# EAGLE design MM_Main (EAGLE 7.2.0)
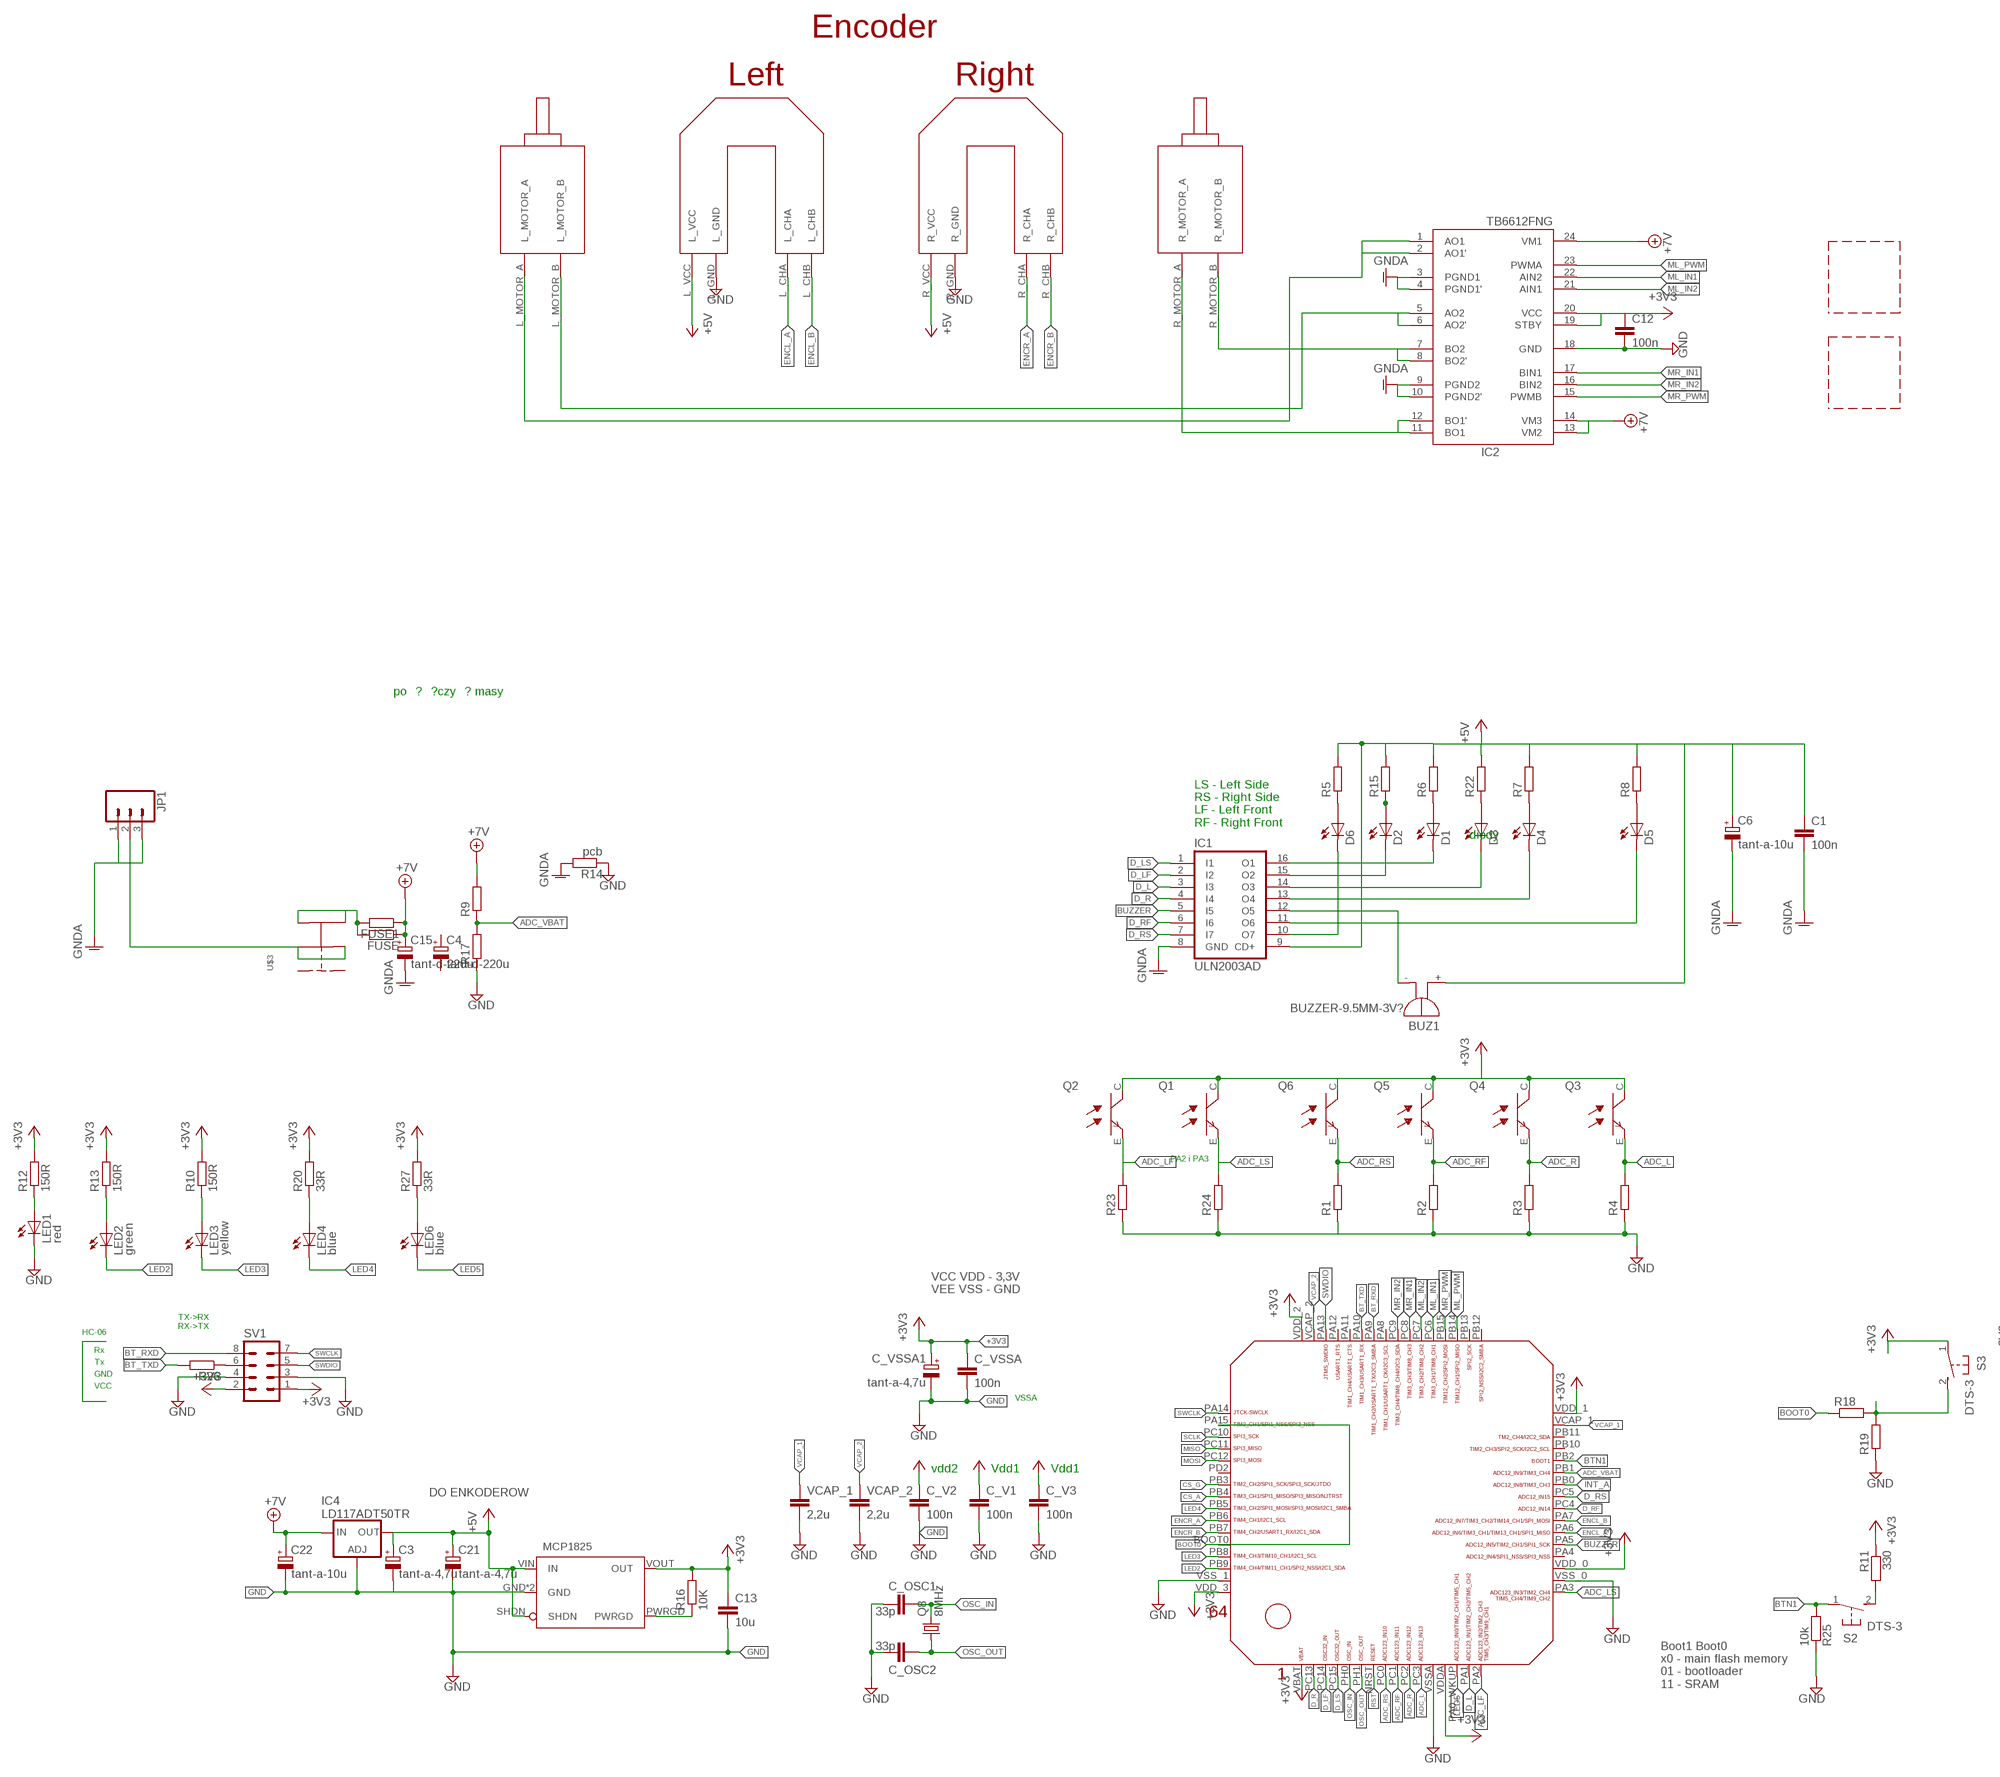
[diagram p0: schematic, sheet 1, part 1 of 2]
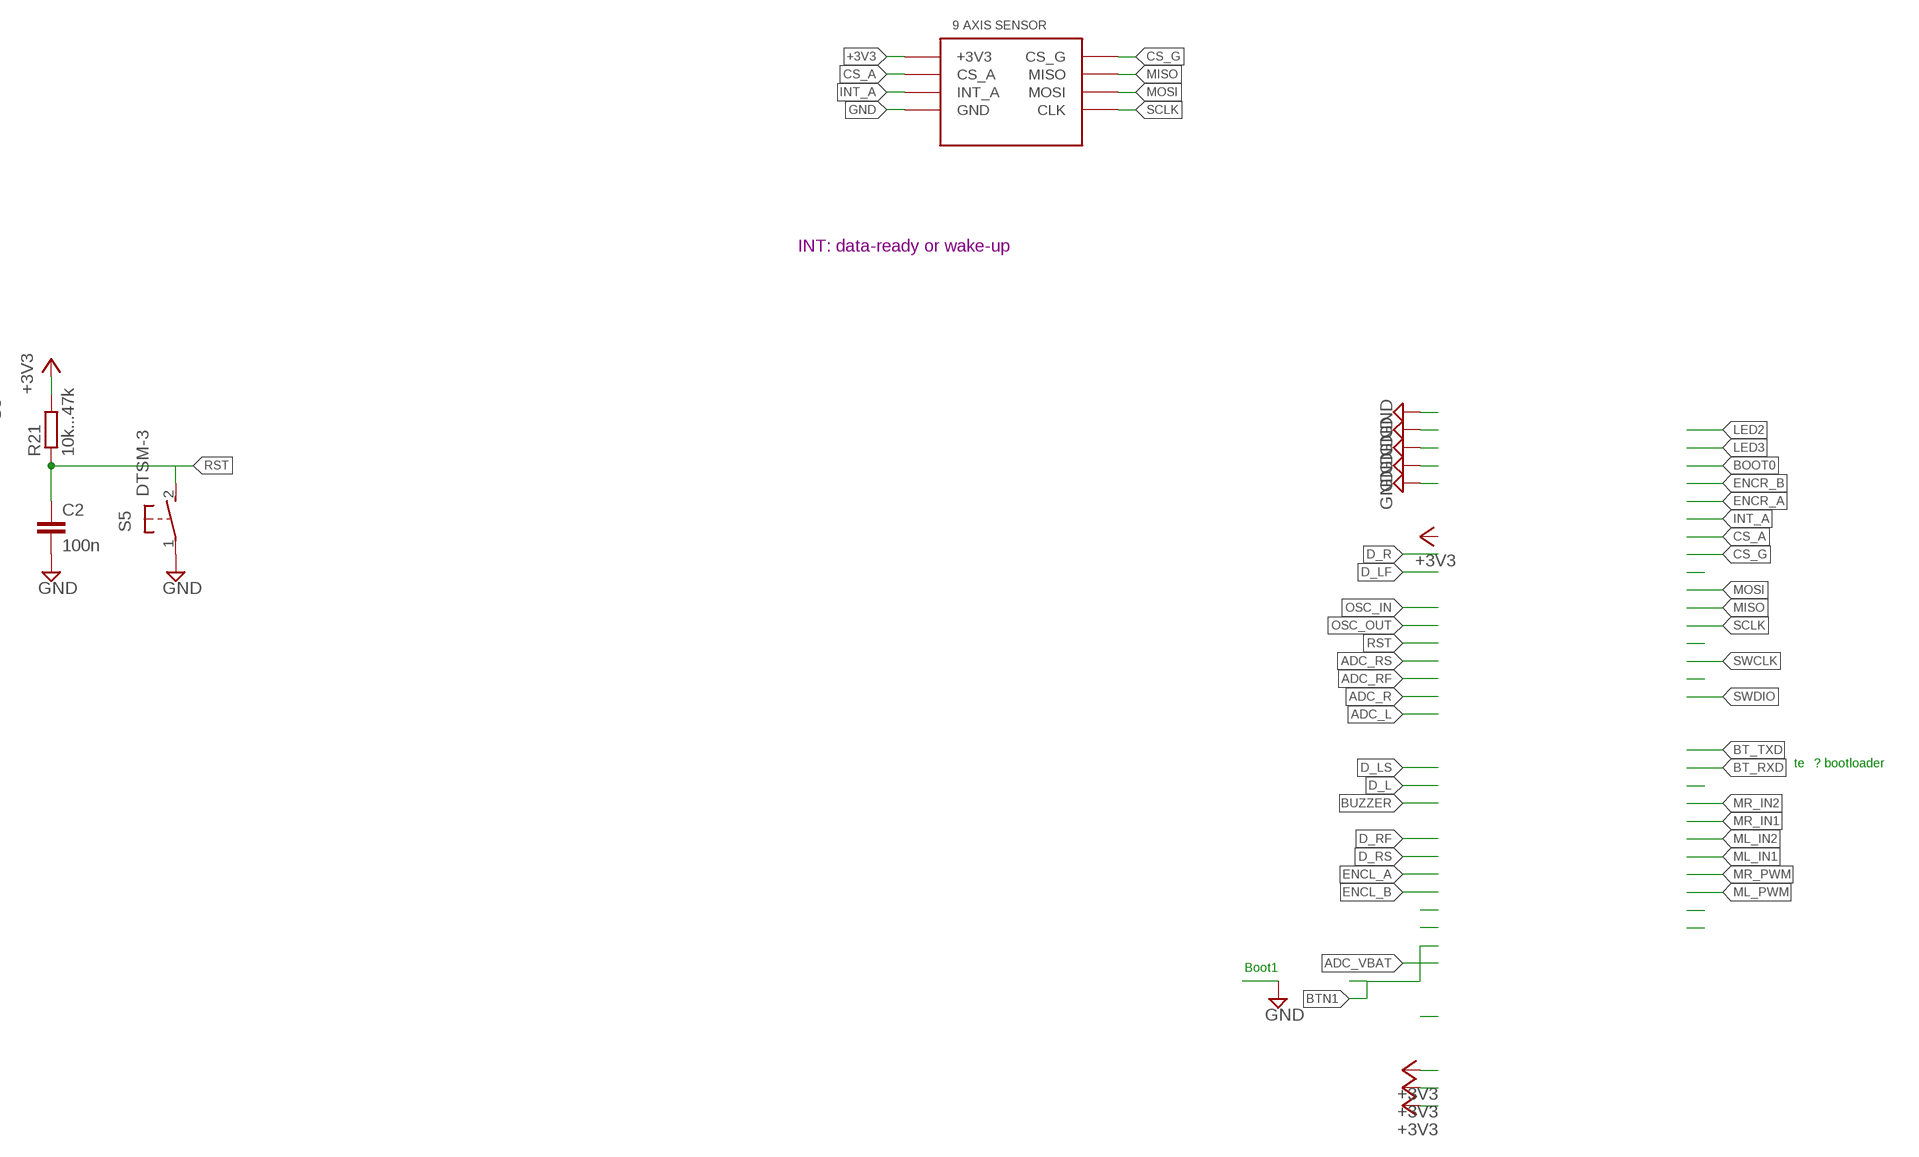
[diagram p1: schematic, sheet 1, part 2 of 2]

## Parts
BUZ1  BUZZER-9.5MM-3V?  BUZZER-9.5MM  [BUZZER-9.5MM]
C1  100n  C-EUC0805  [C0805]
C2  100n  C-EUC0805  [C0805]
C3  tant-a-4,7u  CPOL-EUSMCA  [SMC_A]
C4  tant-d-220u  CPOL-EUSMCD  [SMC_D]
C6  tant-a-10u  CPOL-EUSMCA  [SMC_A]
C12  100n  C-EUC0603  [C0603]
C13  10u  C-EUC0805  [C0805]
C15  tant-d-220u  CPOL-EUSMCD  [SMC_D]
C21  tant-a-4,7u  CPOL-EUSMCA  [SMC_A]
C22  tant-a-10u  CPOL-EUSMCA  [SMC_A]
C_OSC1  33p  C-EUC0805  [C0805]
C_OSC2  33p  C-EUC0805  [C0805]
C_V1  100n  C-EUC0805  [C0805]
C_V2  100n  C-EUC0805  [C0805]
C_V3  100n  C-EUC0805  [C0805]
C_VSSA  100n  C-EUC0805  [C0805]
C_VSSA1  tant-a-4,7u  CPOL-EUSMCA  [SMC_A]
D1  SFH4545-C  [SFH4545-C]
D2  SFH4545-C  [SFH4545-C]
D3  SFH4545-C  [SFH4545-C]
D4  SFH4545-C  [SFH4545-C]
D5  SFH4545-C  [SFH4545-C]
D6  SFH4545-C  [SFH4545-C]
FUSE  R-EU_M3516  [M3516]
FUSE1  R-EU_M3516  [M3516]
IC1  ULN2003AD  [SO16]
IC2  TB6612FNG  [SSOP24]
IC4  LD117ADT50TR  [DPACK]
IC5  MCP1825  [SOT223-5]
JP1  M03POLAR  [MOLEX-1X3]
L1  LABITYNT  [LABIRYNT]
L2  LABITYNT  [LABIRYNT]
LED1  red  LEDSML1206  [SML1206]
LED2  green  LEDSML1206  [SML1206]
LED3  yellow  LEDSML1206  [SML1206]
LED4  blue  LEDSML1206  [SML1206]
LED6  blue  LEDSML1206  [SML1206]
Q1  TEFT4300  [TEFT4300]
Q2  TEFT4300  [TEFT4300]
Q3  TEFT4300  [TEFT4300]
Q4  TEFT4300  [TEFT4300]
Q5  TEFT4300  [TEFT4300]
Q6  TEFT4300  [TEFT4300]
Q8  8MHz  CRYSTAL_5X3.2MM  [CRYSTAL_5X3.2MM]
R1  R-EU_R0805  [R0805]
R2  R-EU_R0805  [R0805]
R3  R-EU_R0805  [R0805]
R4  R-EU_R0805  [R0805]
R5  R-EU_R0805  [R0805]
R6  R-EU_R0805  [R0805]
R7  R-EU_R0805  [R0805]
R8  R-EU_R0805  [R0805]
R9  R-EU_R0805  [R0805]
R10  150R  R-EU_R0805  [R0805]
R11  330  R-EU_R0805  [R0805]
R12  150R  R-EU_R0805  [R0805]
R13  150R  R-EU_R0805  [R0805]
R14  pcb  R-EU_R0201  [R0201]
R15  R-EU_R0805  [R0805]
R16  10K  R-EU_R0805  [R0805]
R17  R-EU_R0805  [R0805]
R18  R-EU_R0805  [R0805]
R19  R-EU_R0805  [R0805]
R20  33R  R-EU_R0805  [R0805]
R21  10k...47k  R-EU_R0805  [R0805]
R22  R-EU_R0805  [R0805]
R23  R-EU_R0805  [R0805]
R24  R-EU_R0805  [R0805]
R25  10k  R-EU_R0805  [R0805]
R26  R-EU_R0805  [R0805]
R27  33R  R-EU_R0805  [R0805]
S2  DTS-3  [DTS-3]
S3  DTS-3  [DTS-3]
S5  DTSM-3  [DTSM-3]
SV1  MA04-2  [MA04-2]
U$1  9AXIS_MODULE  [9AXIS_SENSOR_MODULE]
U$3  PRZELACZNIK_SUWAKOWY  [PRZELACZNIK_SUWAKOWY]
U$5  MOTOR_MOUNT  [MOTOR_MOUNT]
U$6  STM32F4X5  [STM32F4-LQFP64]
VCAP_1  2,2u  C-EUC0805  [C0805]
VCAP_2  2,2u  C-EUC0805  [C0805]

## Nets
+3V3: C12.1 C13.1 C_V1.1 C_V2.1 C_V3.1 C_VSSA1.+ C_VSSA.1 IC2.19(STBY) IC2.20(VCC) IC5.VOUT(OUT) Q1.C Q2.C Q3.C Q4.C Q5.C Q6.C R10.2 R11.1 R12.2 R13.2 R16.2 R20.2 R21.2 R27.2 S3.1 SV1.1 SV1.2 U$1.P$1(+3V3) U$6.VBAT U$6.VDD_0 U$6.VDD_1 U$6.VDD_2 U$6.VDD_3 U$6.VDDA
+5V: BUZ1.+ C1.1 C3.+ C6.+ C21.+ IC1.9(CD+) IC4.4(OUT) IC5.SHDN IC5.VIN(IN) R5.2 R6.2 R7.2 R8.2 R15.2 R22.2 U$5.L_VCC U$5.R_VCC
+7V: C15.+ C22.+ FUSE1.1 FUSE.1 IC2.13(VM2) IC2.14(VM3) IC2.24(VM1) IC4.3(IN) R9.2
ADC_L: Q3.E R4.2 U$6.PC3
ADC_LF: Q2.E R23.2 U$6.PA2
ADC_LS: Q1.E R24.2 U$6.PA3
ADC_R: Q4.E R3.2 U$6.PC2
ADC_RF: Q5.E R2.2 U$6.PC1
ADC_RS: Q6.E R1.2 U$6.PC0
ADC_VBAT: R9.1 R17.2 U$6.PB1
BOOT0: R18.1 U$6.BOOT0 U$6.PA15
BT_RXD: SV1.8 U$6.PA9
BT_TXD: R26.2 U$6.PA10
BTN1: R25.2 S2.1 U$6.PB2
BUZZER: IC1.5(I5) U$6.PA5
CS_A: U$1.P$2(CS_A) U$6.PB4
CS_G: U$1.P$8(CS_G) U$6.PB3
D_L: IC1.3(I3) U$6.PA1
D_LF: IC1.2(I2) U$6.PC14
D_LS: IC1.1(I1) U$6.PC15
D_R: IC1.4(I4) U$6.PC13
D_RF: IC1.6(I6) U$6.PC4
D_RS: IC1.7(I7) U$6.PC5
ENCL_A: U$5.L_CHA U$6.PA6
ENCL_B: U$5.L_CHB U$6.PA7
ENCR_A: U$5.R_CHA U$6.PB6
ENCR_B: U$5.R_CHB U$6.PB7
GND: C2.2 C3.- C12.2 C13.2 C21.- C22.- C_OSC1.1 C_OSC2.1 C_V1.2 C_V2.2 C_V3.2 C_VSSA1.- C_VSSA.2 IC2.18(GND) IC4.1(ADJ) IC5.GND IC5.GND_TAB(GND) LED1.C R1.1 R2.1 R3.1 R4.1 R14.1 R17.1 R19.1 R23.1 R24.1 R25.1 S5.1 SV1.3 SV1.4 U$1.P$4(GND) U$5.L_GND U$5.R_GND U$6.VSS_0 U$6.VSS_1 U$6.VSSA VCAP_1.2 VCAP_2.2
GNDA: C1.2 C6.- C15.- IC1.8(GND) IC2.3(PGND1) IC2.4(PGND1') IC2.9(PGND2) IC2.10(PGND2') JP1.1 JP1.3 R14.2
INT_A: U$1.P$3(INT_A) U$6.PB0
LED2: LED2.C U$6.PB9
LED3: LED3.C U$6.PB8
LED4: LED4.C U$6.PB5
LED5: LED6.C U$6.PA0_WKUP(PA0_AKUP)
MISO: U$1.P$7(MISO) U$6.PC11
ML_IN1: IC2.22(AIN2) U$6.PC6
ML_IN2: IC2.21(AIN1) U$6.PC7
ML_PWM: IC2.23(PWMA) U$6.PB14
MOSI: U$1.P$6(MOSI) U$6.PC12
MR_IN1: IC2.17(BIN1) U$6.PC8
MR_IN2: IC2.16(BIN2) U$6.PC9
MR_PWM: IC2.15(PWMB) U$6.PB15
N$1: IC5.PWRGD R16.1
N$3: D2.ANODA(A) R15.1
N$4: D6.ANODA(A) R5.1
N$5: IC2.7(BO2) IC2.8(BO2') U$5.R_MOTOR_B
N$6: IC2.11(BO1) IC2.12(BO1') U$5.R_MOTOR_A
N$7: IC2.1(AO1) IC2.2(AO1') U$5.L_MOTOR_A
N$8: LED3.A R10.1
N$10: D1.ANODA(A) R6.1
N$11: D4.ANODA(A) R7.1
N$12: D5.ANODA(A) R8.1
N$17: LED1.A R12.1
N$18: IC2.5(AO2) IC2.6(AO2') U$5.L_MOTOR_B
N$19: BUZ1.- IC1.12(O5)
N$20: D3.ANODA(A) R22.1
N$21: LED2.A R13.1
N$22: LED4.A R20.1
N$23: R18.2 R19.2 S3.2
N$24: FUSE1.2 FUSE.2 U$3.3 U$3.6
N$26: R26.1 SV1.6
N$29: R11.2 S2.2
N$31: LED6.A R27.1
N$36: JP1.2 U$3.2 U$3.5
OSC_IN: C_OSC1.2 Q8.P$2 U$6.PH0
OSC_OUT: C_OSC2.2 Q8.P$1 U$6.PH1
RST: C2.1 R21.1 S5.2 U$6.NRST
SCLK: U$1.P$5(CLK) U$6.PC10
SENSOR_L: D3.KATODA(C) IC1.14(O3)
SENSOR_LF: D2.KATODA(C) IC1.15(O2)
SENSOR_LS: D1.KATODA(C) IC1.16(O1)
SENSOR_R: D4.KATODA(C) IC1.13(O4)
SENSOR_RF: D5.KATODA(C) IC1.11(O6)
SENSOR_RS: D6.KATODA(C) IC1.10(O7)
SWCLK: SV1.7 U$6.PA14
SWDIO: SV1.5 U$6.PA13
VCAP_1: U$6.VCAP_1 VCAP_1.1
VCAP_2: U$6.VCAP_2 VCAP_2.1
Unconnected: C4.+ C4.- U$3.1 U$3.4 U$6.PA4 U$6.PA8 U$6.PA11 U$6.PA12 U$6.PB10 U$6.PB11 U$6.PB12 U$6.PB13 U$6.PD2

## Notes on the sheet
- po�?�?czy�? masy
- LS - Left Side
  RS - Right Side
  LF - Left Front
  RF - Right Front
- diody
- PA2 i PA3
- INT: data-ready or wake-up
- VCC VDD - 3,3V
  VEE VSS - GND
- HC-06
- TX->RX
  RX->TX
- Rx
- Tx
- GND
- VCC
- VSSA
- vdd2 | Vdd1 | Vdd1
- DO ENKODEROW
- te�? bootloader
- Boot1 Boot0
  x0 - main flash memory
  01 - bootloader
  11 - SRAM
- Boot1

## Library data of the parts
BUZ1 = _microMouse:BUZZER-9.5MM
C1 C2 C12 C13 C_OSC1 C_OSC2 C_V1-C_V3 C_VSSA VCAP_1 VCAP_2 = rcl:C-EU: CAPACITOR, European symbol
C3 C4 C6 C15 C21 C22 C_VSSA1 = rcl:CPOL-EU: POLARIZED CAPACITOR, European symbol
D1-D6 = _microMouse:SFH4545
FUSE FUSE1 R9-R14 R16 R17 R20 R27 = resistor:R-EU_: RESISTOR, European symbol
IC1 = uln-udn:ULN2003A: DRIVER ARRAY
IC2 = _microMouse:TB6612FNG: TB6612FNG MOS dual H-bridge motor driver, 1.2A current 3.2A peak 3 or 5v logic and 3-15v motor
IC4 = v-reg:LD117A?*: Low drop fixed and adjustable positive voltage regulators 1 A Source: http://www.st.com/stonline/products/literature/ds/7194/ld1117axx.pdf
IC5 = _microMouse:MCP1825
JP1 = SparkFun-Connectors:M03: Header 3 Standard 3-pin 0.1" header. Use with straight break away headers (SKU : PRT-00116), right angle break away headers (PRT-00553), swiss pins (PRT-00743), machine pins (PRT-00117), and female headers (PRT-00115). Molex polarized connector foot print use with SKU : PRT-08232 with associated crimp pins and housings.
L1 L2 = _microMouse:LABITYNT
LED1-LED4 LED6 = led:LED: LED OSRAM: - CHIPLED LG R971, LG N971, LY N971, LG Q971, LY Q971, LO R971, LY R971 LH N974, LH R974 LS Q976, LO Q976, LY Q976 LO Q996 - Hyper CHIPLED LW Q18S LB Q993, LB Q99A, LB R99A - SideLED LS A670, LO A670, LY A670, LG A670, LP A670 LB A673, LV A673, LT A673, LW A673 LH A674 LY A675 LS A676, LA A676, LO A676, LY A676, LW A676 LS A679, LY A679, LG A679 - Hyper Micro SIDELED�? LS Y876, LA Y876, LO Y876, LY Y876 LT Y87S - SmartLED LW L88C, LW L88S LB L89C, LB L89S, LG L890 LS L89K, LO L89K, LY L89K LS L896, LA L896, LO L896, LY L896 - TOPLED LS T670, LO T670, LY T670, LG T670, LP T670 LSG T670, LSP T670, LSY T670, LOP T670, LYG T670 LG T671, LOG T671, LSG T671 LB T673, LV T673, LT T673, LW T673 LH T674 LS T676, LA T676, LO T676, LY T676, LB T676, LH T676, LSB T676, LW T676 LB T67C, LV T67C, LT T67C, LS T67K, LO T67K, LY T67K, LW E67C LS E67B, LA E67B, LO E67B, LY E67B, LB E67C, LV E67C, LT E67C LW T67C LS T679, LY T679, LG T679 LS T770, LO T770, LY T770, LG T770, LP T770 LB T773, LV T773, LT T773, LW T773 LH T774 LS E675, LA E675, LY E675, LS T675 LS T776, LA T776, LO T776, LY T776, LB T776 LHGB T686 LT T68C, LB T68C - Hyper Mini TOPLED�? LB M676 - Mini TOPLED Santana�? LG M470 LS M47K, LO M47K, LY M47K Source: http://www.osram.convergy.de LUXEON: - LUMILED�? LXK2-PW12-R00, LXK2-PW12-S00, LXK2-PW14-U00, LXK2-PW14-V00 LXK2-PM12-R00, LXK2-PM12-S00, LXK2-PM14-U00 LXK2-PE12-Q00, LXK2-PE12-R00, LXK2-PE12-S00, LXK2-PE14-T00, LXK2-PE14-U00 LXK2-PB12-K00, LXK2-PB12-L00, LXK2-PB12-M00, LXK2-PB14-N00, LXK2-PB14-P00, LXK2-PB14-Q00 LXK2-PR12-L00, LXK2-PR12-M00, LXK2-PR14-Q00, LXK2-PR14-R00 LXK2-PD12-Q00, LXK2-PD12-R00, LXK2-PD12-S00 LXK2-PH12-R00, LXK2-PH12-S00 LXK2-PL12-P00, LXK2-PL12-Q00, LXK2-PL12-R00 Source: www.luxeon.com KINGBRIGHT: KA-3528ASYC Source: www.kingbright.com
Q1-Q6 = _MM:TEFT4300
Q8 = _microMouse:CRYSTAL_5X3.2MM
R1-R8 R15 R18 R19 R21-R26 = rcl:R-EU_: RESISTOR, European symbol
S2 S3 = switch-tact:DTS-3
S5 = switch-tact:DTSM-3
SV1 = con-lstb:MA04-2: PIN HEADER; OC_FARNELL: unknown; OC_NEWARK: unknown
U$1 = _microMouse:9AXIS_MODULE
U$3 = _microMouse:PRZELACZNIK_SUWAKOWY
U$5 = _microMouse:MOTOR_MOUNT
U$6 = _microMouse:STM32F4X5

## Board
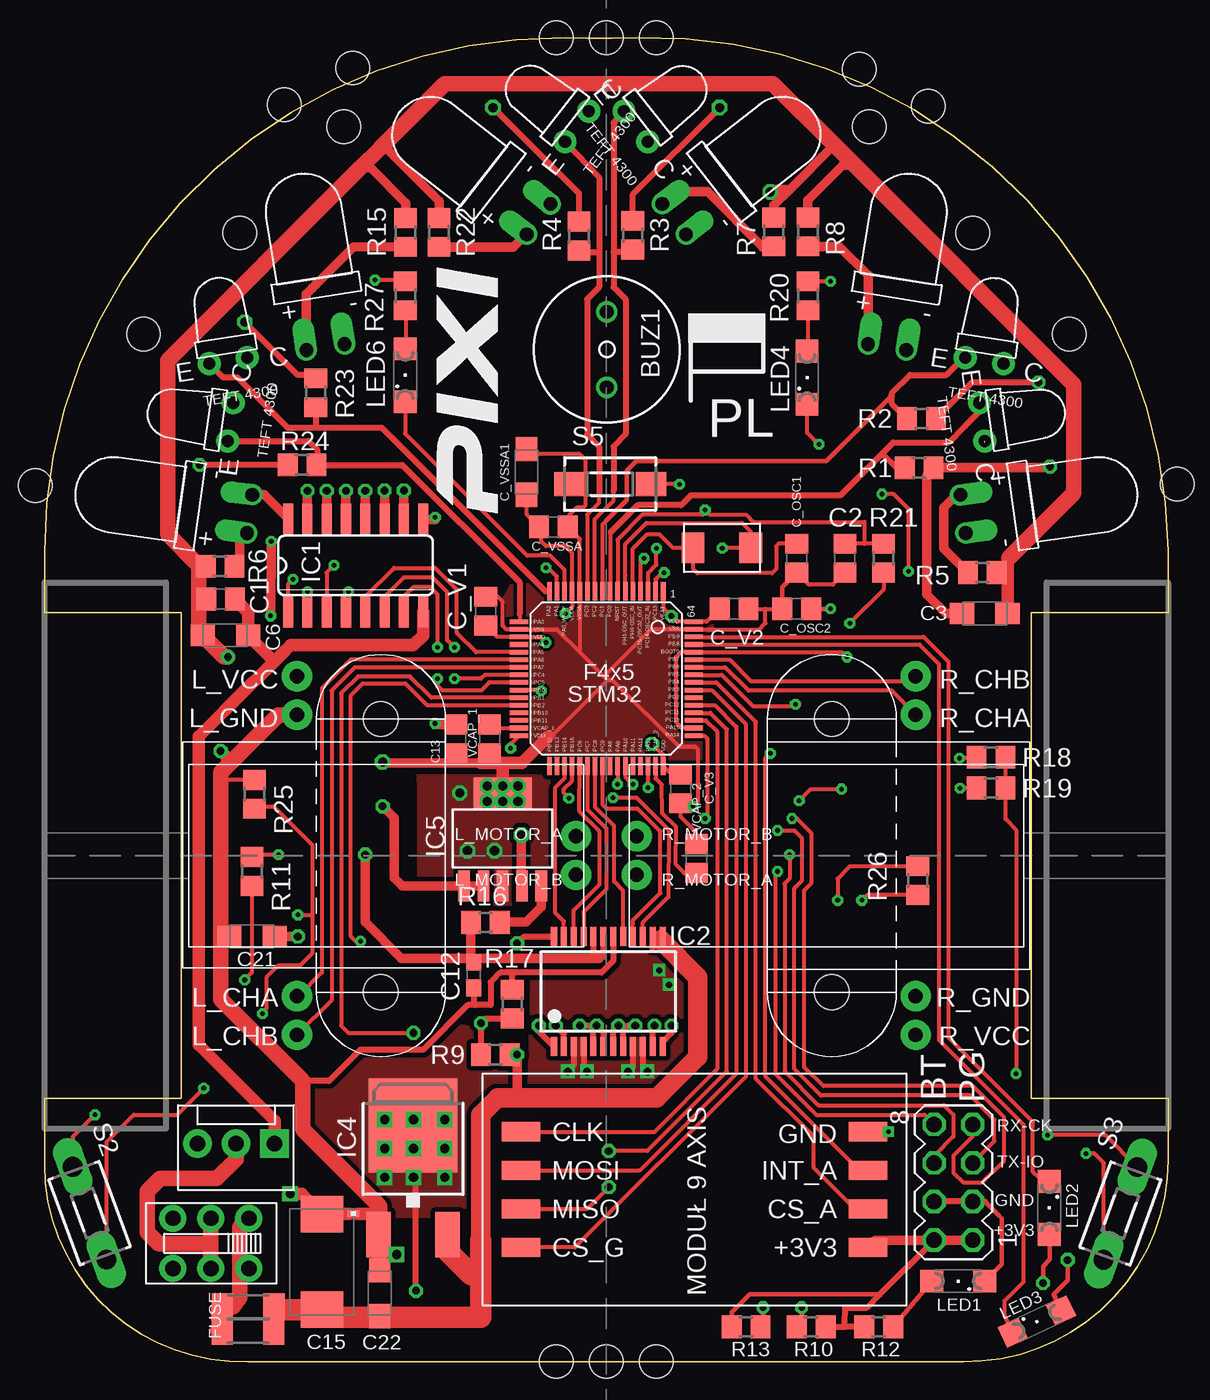
[diagram p2: board, top side]
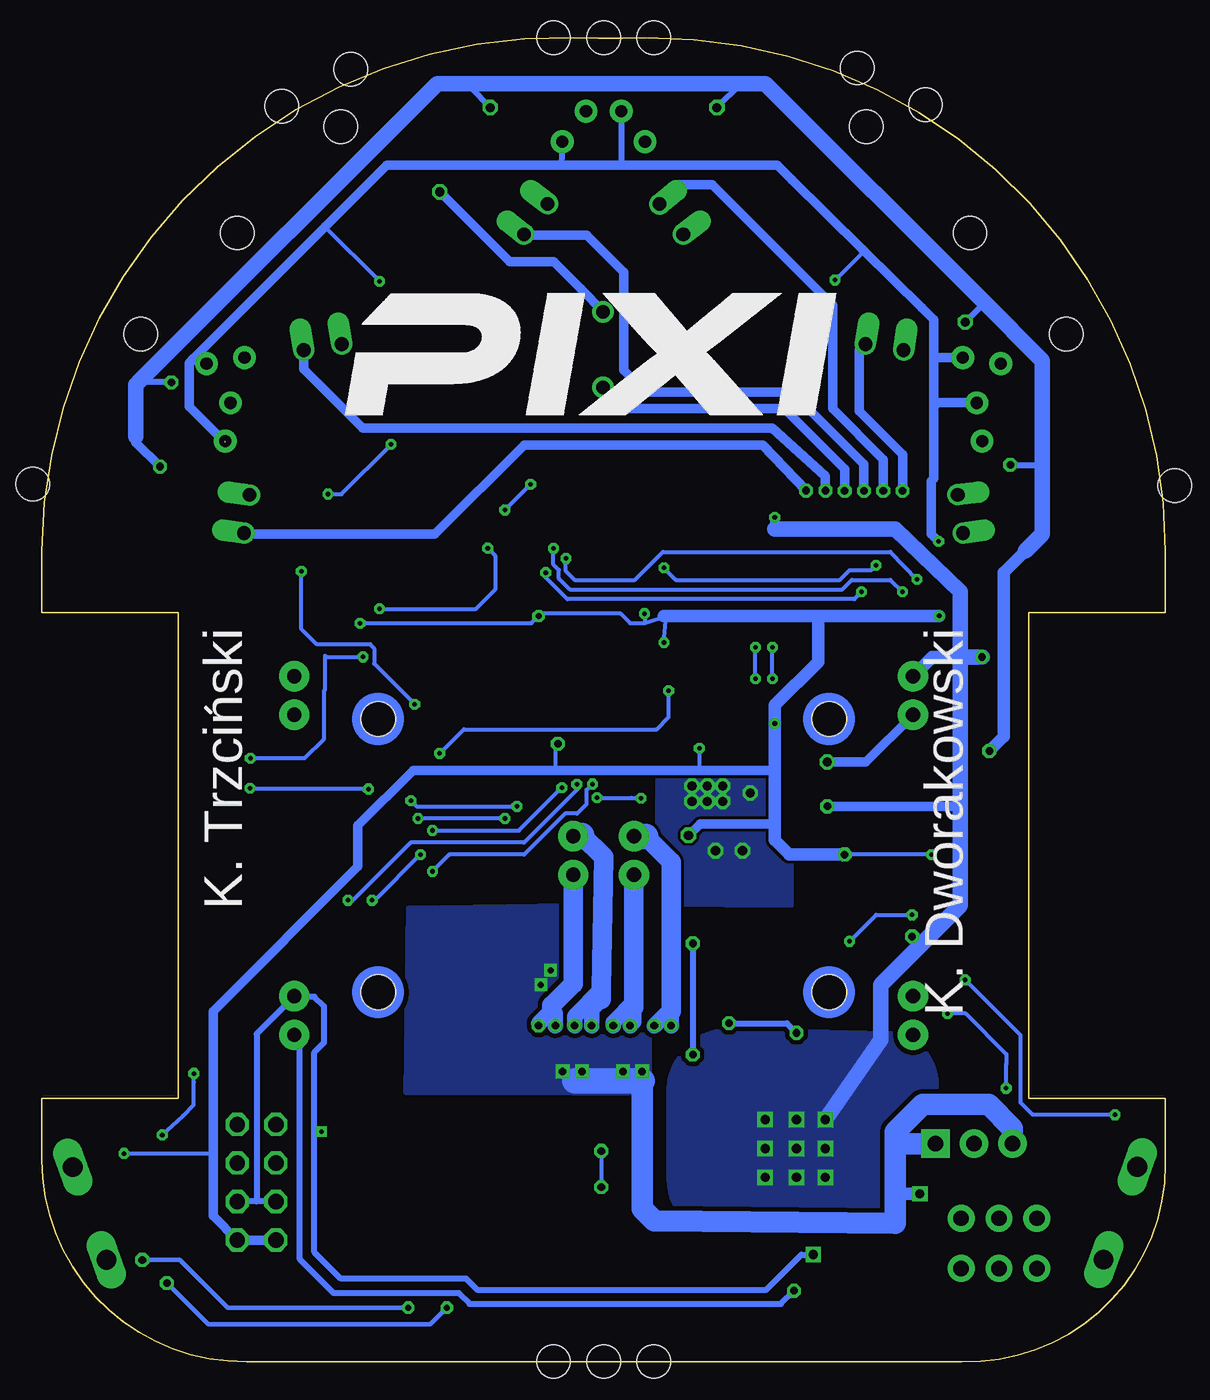
[diagram p3: board, bottom side, seen from below]

Size 74 x 87.2 mm. Coordinates in mm from the lower left corner, seen from the top.
Outline: 0,13.4 0,13 arc92 13.4,0 60.5,0 arc91 74,13.3 74,13.4
Outline: 0,53.3 0,53.4 arc-91 34.2,87.2
Outline: 74,53.3 74,53.4 arc91 39,87.2 arc-2 34.1,87.2
Copper layers (1*16): Top 0.035mm / dielectric 1.5mm / Bottom 0.035mm
Design rules "default *": minimum track width 10mil, minimum drill 0.3mm, track to track 8mil, track to pad 8mil, pad to pad 7mil, via to via 8mil, smd to smd 0mil, copper to edge 12mil, drill to drill 8mil, minimum pad ring 10mil, minimum via ring 8mil, stop-mask expansion 4mil, vias tented up to drill 0mil, thermal gap 10mil
Holes 2.2 mm at 19.7,81.34 12.87,74.36 6.52,67.69 54.3,81.34 61.13,74.36 67.48,67.69 20.29,85.22 15.8,82.8 -0.6,57.7 53.66,85.15 58.2,82.7 74.6,57.8 37,87.2 33.7,87.2 40.3,87.2 37,0 33.7,0 40.3,0

### Footprints (pad centres in the part's own frame; a part is rotated, then mirrored left to right if it is on the bottom)
BUZZER-9.5MM = drill 0.9: + -2.481,0; - 2.499,0
C0805 = smd 1.3 x 1.5: 1 -0.95,0; 2 0.95,0
SMC_A = smd 1.6 x 1.4: + -1.5,0; - 1.5,0
SMC_D = smd 2.4 x 2.8: + -3.15,0; - 3.15,0
C0603 = smd 1.1 x 1: 1 -0.85,0; 2 0.85,0
SFH4545-C = drill 0.9 offset: ANODA -1.27,-0.76; KATODA 1.27,-0.76
M3516 = smd 1.4 x 1.8: 1 -1.7,0; 2 1.7,0
SO16 = smd 0.66 x 2.032: 1 -4.445,-3.073; 2 -3.175,-3.073; 3 -1.905,-3.073; 4 -0.635,-3.073; 5 0.635,-3.073; 6 1.905,-3.073; 7 3.175,-3.073; 8 4.445,-3.073; 9 4.445,3.073; 10 3.175,3.073; 11 1.905,3.073; 12 0.635,3.073; 13 -0.635,3.073; 14 -1.905,3.073; 15 -3.175,3.073; 16 -4.445,3.073
SSOP24 = smd 0.4 x 1.25: 1 -3.575,-3.625; 2 -2.925,-3.625; 3 -2.275,-3.625; 4 -1.625,-3.625; 5 -0.975,-3.625; 6 -0.325,-3.625; 7 0.325,-3.625; 8 0.975,-3.625; 9 1.625,-3.625; 10 2.275,-3.625; 11 2.925,-3.625; 12 3.575,-3.625; 13 3.575,3.625; 14 2.925,3.625; 15 2.275,3.625; 16 1.625,3.625; 17 0.975,3.625; 18 0.325,3.625; 19 -0.325,3.625; 20 -0.975,3.625; 21 -1.625,3.625; 22 -2.275,3.625; 23 -2.925,3.625; 24 -3.575,3.625
DPACK = smd 1.6 x 3: 1 -2.28,-4.8; 3 2.28,-4.8 | smd 5.8 x 6.2: 4 0,2.38
SOT223-5 = smd 0.762 x 2.032: GND 0.095,-3.365; PWRGD 2.635,-3.365; SHDN -2.445,-3.365; VIN -1.175,-3.365; VOUT 1.365,-3.365 | smd 3.81 x 2.007: GND_TAB 0.095,2.777
MOLEX-1X3 = drill 1.016 pad 1.88 square: 1 0,0 | drill 1.016 pad 1.88: 2 2.54,0; 3 5.08,0
SML1206 = smd 1.5 x 1.5: A 1.75,0; C -1.75,0
TEFT4300 = drill 0.8 pad 1.5: C 1.27,-1.77; E -1.27,-1.77
CRYSTAL_5X3.2MM = smd 1.5 x 2: P$1 2.1,0.13; P$2 -1.7,0.13
R0805 = smd 1.3 x 1.5: 1 -0.95,0; 2 0.95,0
R0201 = smd 0.28 x 0.43: 1 -0.255,0; 2 0.255,0
DTS-3 = drill 1.3 long: 1 -3.25,0; 2 3.25,0
DTSM-3 = smd 2 x 1.6: 1 -2.7,0; 2 2.7,0
MA04-2 = drill 1.016 octagon: 1 -3.81,-1.27; 2 -3.81,1.27; 3 -1.27,-1.27; 4 -1.27,1.27; 5 1.27,-1.27; 6 1.27,1.27; 7 3.81,-1.27; 8 3.81,1.27
9AXIS_SENSOR_MODULE = smd 2.54 x 1.27: P$1 -11.43,3.81; P$2 -11.43,1.27; P$3 -11.43,-1.27; P$4 -11.43,-3.81; P$5 11.43,-3.81; P$6 11.43,-1.27; P$7 11.43,1.27; P$8 11.43,3.81
PRZELACZNIK_SUWAKOWY = drill 1 pad 1.778: 1 -1.23,0; 2 1.27,0; 3 3.77,0; 4 -1.23,-3.3; 5 1.27,-3.3; 6 3.77,-3.3
MOTOR_MOUNT = drill 0.95 pad 2: L_CHA -20.375,-10.1; L_CHB -20.375,-12.64; L_GND -20.375,8.44; L_MOTOR_A -2,0.44; L_MOTOR_B -2,-2.1; L_VCC -20.375,10.98; R_CHA 20.375,8.44; R_CHB 20.375,10.98; R_GND 20.375,-10.1; R_MOTOR_A 2,-2.1; R_MOTOR_B 2,0.44; R_VCC 20.375,-12.64 | hole 2.286: 14.85,8.17; 14.85,-9.83; -14.85,-9.83; -14.85,8.17
STM32F4-LQFP64 = smd 1.2 x 0.3: BOOT0 -5.75,-1.75; PA3 5.75,-3.75; PA4 5.75,-2.25; PA5 5.75,-1.75; PA6 5.75,-1.25; PA7 5.75,-0.75; PA14 -5.75,3.75; PA15 -5.75,3.25; PB0 5.75,0.75; PB1 5.75,1.25; PB2 5.75,1.75; PB3 -5.75,0.75; PB4 -5.75,0.25; PB5 -5.75,-0.25; PB6 -5.75,-0.75; PB7 -5.75,-1.25; PB8 -5.75,-2.25; PB9 -5.75,-2.75; PB10 5.75,2.25; PB11 5.75,2.75; PC4 5.75,-0.25; PC5 5.75,0.25; PC10 -5.75,2.75; PC11 -5.75,2.25; PC12 -5.75,1.75; PD2 -5.75,1.25; VCAP_1 5.75,3.25; VDD_0 5.75,-2.75; VDD_1 5.75,3.75; VDD_3 -5.75,-3.75; VSS_0 5.75,-3.25; VSS_1 -5.75,-3.25 | smd 0.3 x 1.2: NRST -0.75,-5.75; PA0_WKUP 2.75,-5.75; PA1 3.25,-5.75; PA2 3.75,-5.75; PA8 -0.25,5.75; PA9 -0.75,5.75; PA10 -1.25,5.75; PA11 -1.75,5.75; PA12 -2.25,5.75; PA13 -2.75,5.75; PB12 3.75,5.75; PB13 3.25,5.75; PB14 2.75,5.75; PB15 2.25,5.75; PC0 -0.25,-5.75; PC1 0.25,-5.75; PC2 0.75,-5.75; PC3 1.25,-5.75; PC6 1.75,5.75; PC7 1.25,5.75; PC8 0.75,5.75; PC9 0.25,5.75; PC13 -3.25,-5.75; PC14 -2.75,-5.75; PC15 -2.25,-5.75; PH0 -1.75,-5.75; PH1 -1.25,-5.75; VBAT -3.75,-5.75; VCAP_2 -3.25,5.75; VDD_2 -3.75,5.75; VDDA 2.25,-5.75; VSSA 1.75,-5.75

### Placement (x,y rotation side)
BUZ1  37.03,66.68 270 top
C1  11.6,50.23 0 top
C2  52.72,52.93 270 top
C3  61.92,49.27 180 top
C4  -233.26,-67.18 0 top  (outside the outline)
C6  11.92,47.85 0 top
C12  28.27,25.46 270 top
C13  27.09,41.02 270 top
C15  18.27,6.57 90 top
C21  13.66,28 180 top
C22  22.08,4.51 90 top
C_OSC1  49.54,52.93 90 top
C_OSC2  49.54,49.59 0 top
C_V1  29.06,49.43 90 top
C_V2  45.41,49.59 0 top
C_V3  41.89,37.73 270 top
C_VSSA  33.51,54.99 0 top
C_VSSA1  31.75,58.61 90 top
D1  12.75,55.95 82 top
D2  18.39,67.59 9 top
D3  31.94,75.73 52 top
D4  42.07,75.74 308 top
D5  55.61,67.58 351 top
D6  61.25,55.94 278 top
FUSE  13.4,2.01 180 top
FUSE1  13.41,3.61 180 top
IC1  20.49,52.45 0 top
IC2  37.13,24.38 0 top
IC4  24.27,13.18 0 top
IC5  30.08,34.7 0 top
JP1  15.16,14.35 180 top
L1  217.5,32.92 0 top  (outside the outline)
L2  37,33.24 0 top
LED1  60.18,5.3 180 top
LED2  66.18,10.13 270 top
LED3  65.35,2.63 25 top
LED4  50.22,64.81 90 top
LED6  23.75,64.97 90 top
Q1  10.5,62.15 82 top
Q2  11.82,67.69 9 top
Q3  33.67,82.45 52 top
Q4  40.33,82.45 308 top
Q5  62.18,67.69 351 top
Q6  63.5,62.15 278 top
Q8  44.41,53.48 0 top
R1  57.6,58.88 180 top
R2  57.76,62.13 180 top
R3  38.75,74.2 270 top
R4  35.2,74.14 270 top
R5  61.77,51.97 0 top
R6  11.57,52.4 180 top
R7  48.02,74.41 90 top
R8  50.28,74.41 90 top
R9  29.7,20.22 0 top
R10  50.49,2.29 0 top
R11  13.66,32.29 270 top
R12  54.94,2.29 180 top
R13  46.21,2.29 180 top
R14  20.33,9.75 180 top
R15  23.77,74.38 90 top
R16  29.03,28.92 180 top
R17  30.81,23.56 270 top
R18  62.34,39.81 0 top
R19  62.34,37.78 0 top
R20  50.28,70.2 90 top
R21  55.26,52.93 270 top
R22  25.98,74.38 90 top
R23  17.86,63.82 270 top
R24  16.96,59.07 0 top
R25  13.82,37.37 270 top
R26  57.51,31.69 270 top
R27  23.77,70.2 90 top
S2  2.96,9.78 110 top
S3  70.86,9.75 70 top
S5  37.25,57.81 0 top
SV1  59.86,11.81 90 top
U$1  42.81,11.33 180 top
U$3  9.69,9.43 0 top
U$5  37,34.16 0 top
U$6  37,44.99 180 top
VCAP_1  29.31,41.02 270 top
VCAP_2  42.94,33.15 90 top

### Tracks (layer width: path | path; a pad name or v marks a point on that pad's centre or on a via)
+3V3  (via drill 0.3, 0.4, 0.5, 0.6)  (1 unrouted)
  Top 0.254: R11.1 13.67,33.4 v15.41,33.4 | v34.3,49.27 34.75,49.72 U$6.VDDA 34.75,53.27 34.3,53.72 33.03,53.72 32.71,54.04 32.71,54.83 C_VSSA.1 31.75,55.8 C_VSSA1.+ | v33.03,47.37 32.66,47.74 U$6.VDD_0 29.81,47.74 C_V1.1 | C_V2.1 43.61,48.74 U$6.VDD_3 41.66,48.74 v41.29,49.12 40.75,49.65 U$6.VBAT | v40.02,40.7 40.75,39.97 U$6.VDD_2 41.51,38.48 C_V3.1 | R21.2 55.26,50.86 v53.03,48.64 | R27.2 23.68,71.25 v21.76,71.25 | R20.2 50.3,71.17 v51.76,71.17 | U$6.VDD_1 30.7,40.69 v30.7,40.4 | 68.59,13.52 v68.59,13.71 69.13,13.71 69.77,13.08 69.77,6.97 S3.1
  Top 0.305: C12.1 28.27,26.41 28.11,26.57 | R13.2 45.26,3.24 46.45,4.43 55.02,4.43
  Top 0.406: IC2.20 36.15,26.84 36.05,26.73 36.68,26.73 36.8,26.85 IC2.19 | R10.2 52.72,2.29 | SV1.2 55.02,4.43 54.14,3.55 52.72,3.56 52.72,2.44 52.72,2.29 | R12.2 52.72,2.29 | C_VSSA.1 32.08,55.47
  Top 0.61: 36.68,26.73 36.52,26.57 28.11,26.57 23.51,26.57 21.12,28.95 v21.12,33.4 | v14.9,49.12 v14.93,54.04 | SV1.1 SV1.2 54.72,8 U$1.P$1 | IC5.VOUT 31.41,31.3 | 31.41,31.3 31.46,31.25 | R16.2 28.08,26.5 C12.1 | 31.41,31.3 v31.41,34.67 | C13.1 25.8,41.97 v25.73,42.04
  Bottom 0.254: 34.3,48.64 35.25,48.64 35.89,49.27 41.13,49.27 v41.29,49.12 41.76,48.64 v53.03,48.64 | 34.3,48.64 32.87,49.12 v33.03,47.37 | v15.41,33.4 v21.12,33.4 | v34.3,49.27 34.3,48.64 | v40.02,40.7 40.17,40.54 40.17,38.95 | v68.59,13.71 62.72,13.71 | v21.76,71.25 19.85,73.16 19.85,73.17 | v51.76,71.17 55.34,74.75 | v30.7,40.4 30.7,38.95
  Bottom 0.406: Q3.C 35.84,78.91 35.73,78.8 | Q4.C 39.79,78.8 | 39.79,78.8
  Bottom 0.61: SV1.2 SV1.1 62.72,9.59 62.72,13.71 62.72,23.08 53.19,32.61 53.19,35.3 49.54,38.96 49.06,38.95 40.17,38.95 30.7,38.95 25.73,38.95 25.73,38.96 | 61.92,60.55 64.31,62.93 64.31,65.78 63.99,66.1 | v14.93,54.04 15.41,54.51 15.41,58.01 15.25,58.16 15.25,62.93 | 15.25,62.93 15.25,65.94 | 15.25,65.94 15.25,68.64 16.05,69.44 19.85,73.17 19.98,73.29 24.62,77.85 25.57,78.8 35.73,78.8 39.79,78.8 51.29,78.8 55.34,74.75 63.99,66.1 | Q1.C 15.02,63.16 15.25,62.93 | Q2.C 15.05,66.14 15.25,65.94 | Q5.C 63.63,65.74 63.99,66.1 | 25.73,34.35 25.82,34.45 25.82,35.43 30.65,35.43 v31.41,34.67
  Bottom 0.813: 33.03,49.12 32.87,49.12 22.87,49.12 | 22.87,49.12 v14.9,49.12 | v21.12,33.4 24.78,33.4 25.73,34.35 25.73,38.96 25.73,41.53 v25.73,42.04 25.73,43.24 22.87,46.1 22.87,49.12
+5V  (via drill 0.3, 0.5, 0.6)
  Top 0.406: v24.46,4.67 24.46,13.87 v24.3,14.03
  Top 0.61: IC1.9 24.99,55.47 25.73,55.47 v25.73,55.62 | C21.+ v16.68,28 | C3.+ 63.35,49.27 | 49.06,77.22 52,80.15 | v47.8,77.06 47.95,77.22 49.06,77.22 | 50.28,75.73 R8.2 50.26,75.38 50.26,76.5 52.56,78.8 53.35,78.8 | R7.2 48.02,76.17 49.06,77.22 | 20.81,78.64 21.47,78.64 23.79,76.33 23.79,75.36 R15.2 | 22.08,79.91 22.54,79.91 26,76.45 26,75.35 R22.2 | IC5.VIN IC5.SHDN 23.57,31.34 23.03,31.88 23.03,35.81 v22.27,36.57
  Top 0.813: C3.+ 63.42,51.97 | 63.42,51.97 63.42,52.84 63.51,52.93 64.46,53.88 | R5.2 63.42,51.97
  Top 1.016: v22.39,15.94 23.03,17.05 | v22.39,15.94 v24.3,15.94 | v22.39,14.03 v24.3,14.03 25.73,14.03 24.68,15.08 IC4.4 24.27,15.65 v22.39,15.94 | 63.51,52.93 67.8,57.21 67.8,64.36 53.35,78.8 52,80.15 47.95,84.2 26.36,84.2 22.08,79.91 20.81,78.64 8.11,65.94 8.11,54.51 10.17,52.45 10.17,52.29 | v12.08,46.42 11.85,46.42 C6.+ 10.17,48.09 10.17,50.23 | 10.17,52.29 10.17,50.23 | C1.1 10.17,50.23 | R6.2 10.28,52.4 10.17,52.29
  Bottom 0.406: U$5.R_VCC 57,21.15 57,6.73 54.78,4.51 46.52,4.51 45.82,3.8 25.32,3.8 v24.46,4.67
  Bottom 0.61: v25.73,55.62 25.73,54.83 | v16.68,28 16.52,28 16.12,27.45 | BUZ1.+ 38.5,70.68 40.27,72.45 43.19,72.45 v47.8,77.06 | v22.27,36.57 13.63,36.57 13.5,36.7
  Bottom 0.813: U$5.L_VCC 15.35,46.42 13.5,46.42
  Bottom 1.016: 25.73,54.83 17.79,54.83 13.51,50.72 13.51,49.28 13.5,49.27 13.5,46.42 | v22.39,15.94 18.74,21.18 18.74,24.83 16.12,27.45 13.5,30.07 13.5,36.7 13.5,46.42 | v12.08,46.42 13.5,46.42
  other vias: 26.36,15.94 26.36,14.03 26.36,12.13 24.3,12.13 22.39,12.13
  pour Top (isolate 0.305, no thermals): 14.77,19.91 14.77,14.03 arc90 19.22,9.59 25.89,9.59 arc90 32.08,15.78 32.08,16.73 arc90 26.68,22.13 16.2,22.13 arc90 14.77,20.7
  pour Bottom (isolate 0.305): 15.41,11.65 arc90 19.38,7.68 28.46,7.68 arc90 32.71,12.45 32.71,18 arc90 28.3,21.91 18.43,21.65 arc90 15.09,18.32
+7V  (via drill 0.5)
  Top 0.254: C22.+ 22.08,2.92
  Top 0.406: IC2.14 40.05,27.24 40.57,27.76 40.07,28.21 IC2.13 | IC2.24 31.59,28.01 v31.13,27.54 | R9.2 31.13,19.27
  Top 0.61: v31.13,20.22 31.13,19.27 31.13,17.52 30.97,17.37
  Top 1.27: 28.74,8 28.74,16.25 29.86,17.37 30.97,17.37 40.33,17.37 43.03,20.06 43.03,25.3 40.57,27.76
  Top 1.422: 28.74,5.71 28.74,2.92 22.08,2.92 18.11,2.92 C15.+ 15.19,3.42 FUSE1.1 15.11,3.35 FUSE.1 | 28.74,5.71 28.74,8 | IC4.3 26.59,7.24 28.11,5.71 28.74,5.71
  Bottom 0.406: v31.13,27.54 v31.13,20.22
ADC_L
  Top 0.254: 35.73,50.76 U$6.PC3 35.75,55.76 35.73,55.78 36.52,56.58 36.52,57.05
  Top 0.406: Q3.E 36.52,78.03 36.52,73.09 | R4.2 35.31,73.09 36.52,73.09 | 36.52,73.09 36.52,70.77 35.73,69.98 35.73,61.09 36.52,60.29 36.52,57.05
ADC_LF
  Top 0.254: 33,50.74 U$6.PA2
  Top 0.406: 33,50.74 22.24,61.5 17.79,61.5 | 17.79,61.5 16.05,61.5 12.71,64.83 11.76,64.83 Q2.E | R23.2 17.86,61.57 17.79,61.5
ADC_LS
  Top 0.254: 31.29,49.27 31.29,48.74 U$6.PA3
  Top 0.406: 31.29,49.27 31.29,51.34 23.55,59.07 R24.2 17.95,59.11 17.95,60.07 17.37,60.65 Q1.E
ADC_R
  Top 0.254: U$6.PC2 36.25,55.51 37.48,56.74 37.48,57.37
  Top 0.406: Q4.E 37.48,81.6 37.48,73.09 | R3.2 38.59,73.09 37.48,73.09 | 37.48,73.09 37.48,70.77 38.27,69.98 38.27,61.09 37.48,60.29 37.48,57.37
ADC_RF
  Top 0.254: U$6.PC1 36.75,55.14 36.75,55.15 37,55.4
  Top 0.305: 37,55.4 38.36,56.76 38.36,58.68 38.98,59.31 51.49,59.31 55.81,63.63
  Top 0.406: R2.2 55.81,63.12 55.81,63.63 55.81,63.8 57,64.99 59.38,64.99 60.31,65.92 Q5.E
ADC_RS
  Top 0.254: 37.32,54.67 37.25,54.6 U$6.PC0
  Top 0.406: 37.32,54.67 39.06,56.42 41.92,56.42 42.56,57.05 52.4,57.05 55.18,59.83 | 55.18,59.83 55.89,60.55 59.54,60.55 60.65,61.66 60.81,61.82 61.57,62.57 Q6.E | R1.2 56.13,58.88 55.18,59.83
ADC_VBAT  (via drill 0.5)
  Top 0.254: v24.3,21.65 20.01,21.65 19.54,22.13 19.54,44.04 20.65,45.15 24.06,45.15 25.47,43.74 U$6.PB1
  Top 0.406: R17.2 29.06,22.61 v28.74,22.29 v28.75,22.29 R9.1
  Bottom 0.406: v28.74,22.29 24.94,22.29 v24.3,21.65
BOOT0  (via drill 0.3)
  Top 0.254: v52.86,46.42 52.53,46.74 U$6.BOOT0 41.92,46.74 41.6,46.42 41.6,42.11 41.98,41.73 U$6.PA15 | R18.1 61.22,39.75 v60.27,39.75
  Bottom 0.254: v52.86,46.42 55.26,46.42 55.34,46.5 55.34,44.27 55.41,44.2 55.41,41.02 56.69,39.75 v60.27,39.75
BT_RXD  (via drill 0.3)
  Top 0.254: v48.27,32.29 48.11,32.29 48.11,18.95 50.81,16.25 57.95,16.25 SV1.8 | U$6.PA9 37.76,39.24 37.76,38.07 v37.74,38.05
  Bottom 0.254: v48.27,32.29 47.16,33.4 42.24,33.4 39.54,36.1 38.75,36.1 38.12,36.73 38.12,37.67 v37.74,38.05
BT_TXD  (via drill 0.3)
  Top 0.254: 54.14,30.7 v53.83,30.38 54.18,30.74 R26.2 | v38.77,38.02 38.73,38.02 38.27,38.48 38.27,39.22 U$6.PA10
  Bottom 0.254: v53.83,30.38 53.51,30.38 49.7,34.19 42.24,34.19 38.77,37.67 v38.77,38.02
BTN1  (via drill 0.3)
  Top 0.254: 13.82,36.57 13.98,36.57 | 13.98,36.57 15.09,36.57 17.63,34.03 17.63,29.43 | 17.63,29.43 17.63,26.89 16.84,26.1 15.41,26.1 14.62,25.3 14.62,23.24 v14.35,22.92 | v20.81,27.68 20.49,27.68 20.17,28 20.17,43.88 20.97,44.67 23.74,44.67 25.18,43.24 U$6.PB2 | v16.68,29.43 17.63,29.43 | R25.2 13.98,36.57 | v10.49,18 8.74,16.25 5.88,16.25 4.08,14.45 S2.1
  Bottom 0.254: v10.49,18 10.49,19.59 10.48,19.59 10.48,20.24 13.16,22.92 v14.35,22.92 | v20.81,27.68 19.06,29.43 v16.68,29.43
BUZZER
  Top 0.254: 20.97,50.07 IC1.5 21.12,50.39 23.03,52.29 25.73,52.29 27.16,50.86 27.16,48 28.42,46.74 U$6.PA5
CS_A
  Top 0.254: U$6.PB4 44.23,44.74 46.84,42.13 46.84,18.64 50.65,14.83 50.65,12.76 53.35,10.06 U$1.P$2
CS_G
  Top 0.254: U$6.PB3 43.94,44.24 46.21,41.97 46.21,18.79 34.94,7.52 U$1.P$8
D_L  (via drill 0.3)
  Top 0.254: v19.06,52.45 18.59,51.97 IC1.3 | U$6.PA1 33.75,51.73 33.19,52.29 v33.03,52.29
  Bottom 0.254: v19.06,52.45 19.38,52.13 20.81,52.13 21.44,51.5 32.24,51.5 v33.03,52.29
D_LF  (via drill 0.3)
  Top 0.254: v17.32,50.7 IC1.2 | U$6.PC14 39.75,51.95 40.3,52.5 v40.3,53.57
  Bottom 0.254: v17.32,50.7 18.11,51.5 20.65,51.5 21.28,50.86 39.22,50.86 39.95,51.59 39.95,52.15 40.3,52.5 v40.3,53.57
D_LS  (via drill 0.3)
  Top 0.254: IC1.1 16.05,51.21 v16.36,51.53 | v39.48,52.91 39.25,52.68 U$6.PC15
  Bottom 0.254: v16.36,51.53 18.11,53.34 33.09,53.34 34.94,51.5 38.91,51.5 39.48,52.07 v39.48,52.91
D_R  (via drill 0.3)
  Top 0.254: IC1.4 19.86,50.55 v20.01,50.7 | U$6.PC13 40.25,51.55 40.7,52 40.78,52 v40.81,51.97
  Bottom 0.254: v20.01,50.7 20.49,50.23 39.38,50.23 40.81,51.66 v40.81,51.97
D_RF  (via drill 0.3)
  Top 0.254: IC1.6 22.39,50.39 23.66,51.66 25.57,51.66 26.52,50.7 26.52,47.53 v27,47.05 | U$6.PC4 28.99,45.24 28.74,44.99 v27,44.99
  Bottom 0.254: v27,44.99 v27,47.05
D_RS  (via drill 0.3)
  Top 0.254: IC1.7 23.51,49.27 23.51,50.23 24.3,51.02 25.41,51.02 25.89,50.55 v25.89,47.05 | U$6.PC5 29.29,44.74 28.77,44.22 26.18,44.22 25.89,44.51 v25.89,44.99
  Bottom 0.254: v25.89,44.99 v25.89,47.05
ENCL_A
  Top 0.254: U$5.L_CHA 16.71,24.06 18.27,25.62 18.27,44.35 20.15,46.24 U$6.PA6
ENCL_B
  Top 0.254: U$5.L_CHB 18.9,23.8 18.9,44.2 20.45,45.74 U$6.PA7
ENCR_A
  Top 0.254: U$5.R_CHA 55.78,44.2 46.37,44.2 44.82,45.74 U$6.PB6
ENCR_B
  Top 0.254: U$5.R_CHB 57.06,44.83 46.52,44.83 45.12,46.24 U$6.PB7
GND  (via drill 0.3, 0.5, 0.6)
  Top 0.254: 36.84,45.15 39.93,48.24 U$6.VSS_1 47.08,48.24 47.48,48.64 47.48,49.59 | 36.84,45.15 37.08,44.91 33.46,41.29 | 63.03,9.43 62.88,9.59 | 49.06,51.98 C_OSC1.1 | 50.02,51.5 C_OSC1.1 | C22.- 22.08,7.52 | 11.6,38.48 11.76,38.32 R25.1 | VCAP_1.2 29.22,39.43 | 35.25,46.74 33.75,48.24 U$6.VSS_0 30.42,48.24 30.17,48.48 30.17,50.07 29.86,50.38 C_V1.2 | 35.25,46.74 U$6.VSSA 35.25,54.2 C_VSSA.2 34.46,55.47 34.5,55.43 | 35.25,46.74 36.84,45.15 | C_V2.2 47.48,49.59 | 47.48,49.59 C_OSC2.1 | C2.2 51.92,51.18 50.34,51.18 C_OSC1.1 | 34.5,55.43 34.5,55.3 | 34.5,55.43 34.5,55.7 35.06,56.26 35.48,56.26 35.6,56.38 35.6,57.78 | U$1.P$4 v55.57,15.14 | C_VSSA1.- 32.04,59.82 35.22,59.82 35.6,59.44 35.6,57.78 | S5.1 35.6,57.78 | VCAP_2.2 42.84,34.19 42.84,34.92 41.89,35.88 C_V3.2 42.09,36.57 v42.72,36.57 43.03,36.89 43.03,40.32 42.84,40.51 41.79,40.51 37.4,44.91 | R19.1 60.36,37.78 v60.29,37.77 | v49.7,36.96 50.46,37.72 v52.49,37.72
  Top 0.305: 61.92,10.54 62.88,9.59 | LED1.C 63.03,6.41 63.03,9.43 | C_OSC2.1 48.11,49.59 | C_OSC2.1 | C_OSC1.1 48.59,51.03 C_OSC2.1 | C12.2 28.27,24.35 | 37.4,44.91 37.08,44.91
  Top 0.406: IC2.18 37.45,26.39 36.68,25.62 30.65,25.62 | 30.65,25.62 30.02,25.62 29.38,24.99 29.38,23.49 28.36,23.49 | 33.46,41.29 33.35,41.18 33.19,41.18 | R17.1 30.81,25.46 30.65,25.62 | v23.19,7.05 22.08,7.05 21.99,7.14 IC4.1 | 17,18.48 18.74,18.48 20.81,20.54 24.94,20.54 27.89,23.49 28.36,23.49 | 61.92,10.54 SV1.4 | 57.34,24.1 U$5.R_GND | R24.1 v10.21,59.07 | R4.1 35.2,76.95 v29.54,82.61 | R3.1 38.75,76.9 v44.46,82.61 | R2.1 61.1,64.52 v65.47,64.52 | 17.77,64.99 16.68,64.99 v13.19,68.48 | 29.22,39.43 28.87,39.43 | 28.74,39.43 28.87,39.43 | 28.87,39.43 28.87,39.5 | 28.27,24.35 28.27,23.59 28.36,23.49
  Top 0.61: C21.- 11.6,28 | 17.77,64.99 R23.1 17.86,65.09 | R2.1 58.71,62.57 | v66.21,58.96 66.29,58.88 R1.1 58.59,58.84 58.11,58.37 58.11,50.55 59.38,49.27 C3.- | v22.27,39.5 22.59,39.43 27.09,39.43 | 27.09,39.43 28.74,39.43 | 12.91,40.11 12.84,40.04 | C13.2 27.09,39.43
  Top 0.813: 33.19,41.18 31.44,39.43 30.14,39.43 | 30.14,39.43 29.22,39.43 28.74,39.43 | R14.1 22.08,9.75 | v11.6,40.23 12.16,39.67 12.47,39.67 | 30.14,39.43 30.17,39.4 IC5.GND_TAB
  Top 1.016: 22.08,7.05 22.08,7.52 22.08,9.75 22.08,10.22 17,15.3 17,18.48 11.6,23.88 11.6,28 11.6,38.48 11.6,38.8 12.47,39.67 12.84,40.04 15.4,42.6 U$5.L_GND
  Bottom 0.254: v42.72,36.57 49.32,36.57 v49.7,36.96 | v52.49,37.72 60.24,37.72 arc90 v60.29,37.77
  Bottom 0.406: 59.86,10.54 59.86,21.58 U$5.R_GND 57.35,24.03 56.05,24.03 55.41,23.4 55.41,21.02 56.05,20.38 56.05,15.14 | 16.21,42.6 U$5.L_GND | v23.19,7.05 23.98,7.05 26.33,4.7 45.29,4.7 46.05,5.46 54.3,5.46 56.05,7.21 56.05,15.14 | 59.86,10.54 SV1.3 | SV1.4 59.86,10.54 | v55.57,15.14 56.05,15.14 | v10.21,59.07 8.22,59.07 8.11,58.96 | v65.47,64.52 67.64,64.52 67.8,64.36 | v29.54,82.61 27.95,84.2 27.48,84.2 | v44.46,82.61 45.73,83.88 45.73,84.2 | v13.19,68.48 12.08,69.59 12.08,69.91
  Bottom 0.61: v66.21,58.96 67.8,60.55 67.8,60.95 | U$5.L_GND 19.73,39.5 v22.27,39.5
  Bottom 0.813: 9.22,53.4 10.65,51.97 10.65,41.18 v11.6,40.23
  Bottom 1.016: 9.22,53.4 8.11,54.51 8.11,58.96 8.11,65.94 12.08,69.91 26.36,84.2 27.48,84.2 45.73,84.2 47.95,84.2 67.64,64.52 | 67.8,64.36 67.8,60.95
  other vias: 29.15,37.92 30.17,37.92 31.18,37.92 29.15,36.91 30.17,36.91 31.18,36.91 27.35,37.46 27.86,33.65 29.63,33.65
  pour Top (isolate 0.305, no thermals): 32.45,38.53 24.6,38.56 24.64,37.84 24.64,30.01 31.63,30.06 32.41,30.04 33.52,30.08 33.44,38.51
  pour Bottom: 24.6,38.56 24.63,30.03 33.52,30.08 33.42,38.51
  pour Top: 30.17,50.07 30.49,50.07 30.59,40.9 32.18,40.9 33.03,39.75 43.83,39.75 43.98,39.91 43.98,50.7 42.72,51.49 30.97,51.49
GNDA  (via drill 0.4, 0.5, 0.6)
  Top 0.406: IC2.3 34.85,19.5 v34.46,19.11 | IC2.4 35.5,19.34 v35.73,19.11 | IC2.9 38.75,19.44 v38.43,19.11 | IC2.10 39.4,19.41 v39.7,19.11 | 11.84,42.85
  Top 0.61: 14.93,46.02 15.2,46.27 15.81,46.81
  Top 0.813: IC1.8 24.94,47.85 24.3,47.21 16.2,47.21 15.81,46.81 11.84,42.85 10.17,41.18 10.17,20.86 15.16,15.87 JP1.1 | R14.2 18.29,9.75 C15.- 16.94,11.05 v16.17,11.05 | 15.2,46.27 15,46.27 C6.- 13.42,49.36 C1.2
  Top 1.422: C15.- 18.11,9.9
  Bottom 0.406: v34.46,19.11 34.46,18.48 | v35.73,19.11 35.73,18.48 | v38.43,19.11 38.43,18.48 | v39.7,19.11 39.54,19.11 38.91,18.48
  Bottom 0.813: v16.17,11.05 17.79,11.05
  Bottom 1.422: 17.79,14.6 17.79,15.14 16,16.94 11.65,16.94 10.08,15.37 JP1.3 | 17.79,14.6 17.79,11.05 17.79,9.11 33.67,9.27 34.46,10.06 34.46,18.48 | JP1.1 17.54,14.35 17.79,14.6
  Bottom 1.676: 34.46,18.48 35.73,18.48 38.43,18.48 38.91,18.48
  other vias: 40.49,25.78 41.13,24.83
  pour Bottom (isolate 0.305, no thermals): 34.9,30.16 33.95,29.21 33.95,17.62 42.78,17.68 50.02,17.68 49.86,29.91
  pour Top (isolate 0.305, no thermals): 32.12,26.48 31.92,18 31.76,17.84 43.67,17.84 45.73,19.91 45.73,28.16 42.46,27.94 33.09,27.94 32.13,27.68
INT_A  (via drill 0.3)
  Top 0.254: v47.8,40.07 47.48,39.75 47.48,18.79 53.67,12.6 U$1.P$3 | v32.71,44.2 32.67,44.24 U$6.PB0
  Bottom 0.254: v47.8,40.07 46.21,41.66 33.51,41.66 32.71,42.45 v32.71,44.2
LED2
  Top 0.254: U$6.PB9 57.9,47.74 59.54,46.1 59.54,21.34 65.1,15.78 65.1,12.51 65.58,12.03 LED2.C
LED3
  Top 0.254: U$6.PB8 57.61,47.24 58.91,45.94 58.91,21.18 64.46,15.62 64.46,5.24 63.24,4.01 63.24,3.02 LED3.C
LED4  (via drill 0.3)
  Top 0.254: U$6.PB5 44.59,45.24 46.65,43.18 49.32,43.18 v49.45,43.31 | v56.91,52.07 56.91,56.16 55.92,57.15 v55.16,57.15 | v51,60.42 50.22,61.2 LED4.C
  Bottom 0.254: v49.45,43.31 52.11,45.97 52.11,46.99 52.37,47.24 55.89,47.24 56.91,48.26 v56.91,52.07 | v55.16,57.15 54.27,57.15 v51,60.42
LED5
  Top 0.254: U$6.PA0_WKUP 34.25,52.15 33.32,53.08 31.79,53.08 23.75,61.12 LED6.C
MISO  (via drill 0.5)
  Top 0.254: v37.16,13.87 39.7,13.87 44.94,19.11 44.94,41.66 43.85,42.74 U$6.PC11 | U$1.P$7 35.73,10.06 v37.16,11.49
  Bottom 0.254: v37.16,13.87 v37.16,11.49
ML_IN1
  Top 0.254: IC2.22 34.85,29.73 36.52,31.39 36.52,34.95 35.23,36.24 U$6.PC6
ML_IN2
  Top 0.254: U$6.PC7 35.75,36.38 37,35.13 37,31.11 35.5,29.62 IC2.21
ML_PWM
  Top 0.254: U$6.PB14 34.25,38.44 34.26,38.44 33.65,37.83 33.65,29.56 34.21,29 34.21,28.57 34.2,28.57 IC2.23
MOSI
  Top 0.254: U$6.PC12 44.15,43.24 45.57,41.81 45.57,18.95 39.22,12.6 U$1.P$6
MR_IN1
  Top 0.254: IC2.17 38.11,31.02 37.51,31.62 37.51,35.28 36.25,36.54 U$6.PC8
MR_IN2
  Top 0.254: IC2.16 38.75,28.88 38.75,29.06 40.56,30.86 40.56,34.92 39.03,36.45 37,36.45 36.75,36.7 36.75,38.73 36.75,38.74 U$6.PC9
MR_PWM  (via drill 0.3)
  Top 0.254: IC2.15 39.41,28.02 39.41,28.93 41.09,30.61 41.12,35.03 39,37.14 v37.43,37.14 | v34.53,37.12 34.21,37.45 34.21,37.72 34.75,38.26 U$6.PB15
  Bottom 0.254: v37.43,37.14 v37.42,37.13 35.17,37.13 35.16,37.12 v34.53,37.12
N$1
  Top 0.61: IC5.PWRGD 32.71,29.95 31.72,28.95 30.01,28.95 R16.1
N$3
  Top 0.61: R15.1 20.34,73.41 17.87,70.94 17.63,70.71 17.25,70.32 D2.ANODA
N$4
  Top 0.61: R5.1 59.23,53.56 59.23,56.26 60.06,57.09 D6.ANODA
N$5  (via drill 0.5)
  Top 0.406: IC2.8 38.1,21.8 38.43,22.13 v38.91,22.13 | IC2.7 37.45,21.79 v37.79,22.13
  Bottom 1.016: v37.79,22.13 37.79,23.24 37.16,23.88 | v38.91,22.13 38.91,22.74 37.15,24.5
  Bottom 1.27: 38.43,34.67 37,33.24 37.15,24.5 37.16,23.88
  Bottom 1.676: U$5.R_MOTOR_B 38.93,34.67 38.43,34.67
N$6  (via drill 0.5)
  Top 0.406: IC2.12 40.7,21.07 41.29,21.65 v41.29,22.13 | IC2.11 40.05,22.01 v40.17,22.13
  Bottom 0.406: v41.29,22.13 41.29,22.29 | 40.33,23.24 40.41,23.16 40.49,23.08 40.57,23 40.41,22.84 40.17,22.6
  Bottom 1.016: 41.29,22.29 40.49,23.08 | v40.17,22.13 40.17,22.92 40.41,23.16
  Bottom 1.27: U$5.R_MOTOR_A 39,24.89 40.41,23.48 40.41,22.84
N$7  (via drill 0.5)
  Top 0.406: 33.55,20.97 IC2.1 32.55,21.75 v32.55,22.13 | IC2.2 34.2,21.59 v33.67,22.13
  Bottom 1.016: v32.55,22.13 32.55,23.08 32.71,23.08 v33.67,22.13
  Bottom 1.27: 34.23,34.6 32.55,32.92 32.55,23.08
  Bottom 1.676: U$5.L_MOTOR_A 34.23,34.6
N$8  (via drill 0.4, 0.5)
  Top 0.305: R10.1 49.86,2.6 v49.86,3.55 | v67.39,6.7 67.39,5.36 66.46,4.44 LED3.A
  Bottom 0.305: v49.86,3.55 61.77,3.55 64.91,6.7 v67.39,6.7
N$10
  Top 0.61: R6.1 12.87,52.75 12.87,54.13 D1.ANODA
N$11
  Top 0.61: R7.1 47.32,73.41 43.67,77.06 41.51,77.06 D4.ANODA
N$12
  Top 0.61: D5.ANODA 54.24,71.56 52.34,73.46 R8.1
N$17
  Top 0.305: LED1.A R12.1
N$18  (via drill 0.5)
  Top 0.406: IC2.5 36.15,21.87 35.89,22.13 v35.25,22.13 | v36.37,22.13 36.8,21.69 IC2.6
  Bottom 1.016: v36.37,22.13 36.37,22.35 35,23.72 | v35.25,22.13 35,22.38 35,23.34
  Bottom 1.27: U$5.L_MOTOR_B 35,23.72 35,23.34
N$19  (via drill 0.5)
  Top 0.61: IC1.12 v21.12,57.37
  Bottom 0.61: v21.12,57.37 21.12,58.8 25.09,62.77 35.73,62.77 37.05,64.09 BUZ1.-
N$20
  Top 0.61: R22.1 30.87,73.43 D3.ANODA
N$21  (via drill 0.4, 0.5)
  Top 0.305: R13.1 47.32,2.45 v47.32,3.55 | v65.77,5.17 65.77,6.29 66.21,6.73 66.21,8.34 LED2.A
  Bottom 0.305: v47.32,3.55 48.43,2.44 63.03,2.44 v65.77,5.17
N$22
  Top 0.254: LED4.A 50.28,66.66 R20.1
N$23  (via drill 0.3)
  Top 0.254: v63.99,18.98 63.99,35.04 63.29,35.74 arc-90 63.29,35.74 R19.2 R18.2 | S3.2 69.85,14.93 v66.07,14.93
  Bottom 0.254: v66.07,14.93 64.7,16.2 64,16.9 64,18.4 63.99,18.41 v63.99,18.98
N$24
  Top 1.016: U$3.3 12.87,8.84 12.87,6.22 | 12.87,6.22 12.87,4.19 12.43,3.61 FUSE1.2 | U$3.6 13.37,6.22 12.87,6.22
  Top 1.422: 11.6,2.1 FUSE.2 11.69,3.35 FUSE1.2 11.7,3.58
N$26  (via drill 0.3)
  Top 0.254: v52.24,30.38 52.24,31.81 53.07,32.64 R26.1 | v49.06,33.4 49.06,31.81 48.75,31.49 48.75,19.11 50.97,16.89 59.23,16.89 59.86,16.25 59.86,14.83 58.59,13.56 SV1.6
  Bottom 0.254: v49.06,33.4 52.08,30.38 v52.24,30.38
N$29  (via drill 0.3)
  Top 0.254: R11.2 13.66,25.62 v13.19,25.14 | v3.32,16.25 1.85,14.79 S2.2
  Bottom 0.254: v3.32,16.25 8.74,16.25 9.54,17.05 9.54,21.49 v13.19,25.14
N$31
  Top 0.254: R27.1 23.79,69.23 23.79,66.76 LED6.A
N$36
  Top 1.016: 10.84,7.75 7.54,7.75 6.77,8.51 6.77,11.22 7.62,12.06 11.35,12.06 12.62,13.33 JP1.2 | 10.84,7.75 10.96,7.87 U$3.2 | U$3.5 10.96,7.62 10.84,7.75
OSC_IN
  Top 0.254: U$6.PH0 38.75,53.56 39.69,54.5 40.5,54.5 41.39,53.61 Q8.P$2 42.72,52.22 42.99,51.94 47.92,51.94 48.18,52.2 48.18,53.72 48.33,53.88 C_OSC1.2
OSC_OUT  (via drill 0.3)
  Top 0.254: U$6.PH1 38.25,51.78 38.24,51.79 38.24,53.85 39.63,55.24 45.94,55.24 46.5,54.69 Q8.P$1 | 46.46,53.56 Q8.P$1 | v44.63,53.59 44.66,53.61 Q8.P$1
  Top 0.305: C_OSC2.2 v51.76,49.59
  Bottom 0.254: v51.76,49.59 45.41,49.59 44.14,50.86 44.14,53.1 v44.63,53.59
RST  (via drill 0.3)
  Top 0.254: U$6.NRST 37.75,54.15 39.38,55.78 43.35,55.78 43.51,55.94 v43.51,56.1 43.83,55.78 46.21,55.78 46.68,55.31 53.99,55.31 53.99,53.88 | 52.88,53.88 C2.1 53.98,53.88 53.99,53.88 | R21.1 53.99,53.88 | v41.81,57.8 39.97,57.8
  Top 0.305: 39.97,57.8 S5.2
  Bottom 0.254: v41.81,57.8 v43.51,56.1
  Bottom 0.305: v41.81,57.8
SCLK
  Top 0.254: U$6.PC10 43.56,42.24 44.3,41.5 44.3,19.27 40.17,15.14 U$1.P$5
SENSOR_L  (via drill 0.5)
  Top 0.61: IC1.14 v18.59,57.37
  Bottom 0.61: v18.59,57.37 18.59,59.44 21.92,62.77 21.92,69.59 29.86,77.53 32.02,77.53 D3.KATODA
SENSOR_LF  (via drill 0.5)
  Top 0.61: IC1.15 v17.32,57.37
  Bottom 0.61: v17.32,57.37 17.32,59.75 20.17,62.61 20.17,66.26 20.17,66.42 20.17,66.62 D2.KATODA
SENSOR_LS
  Top 0.61: IC1.16 14.47,57.1 D1.KATODA
SENSOR_R  (via drill 0.5)
  Top 0.61: IC1.13 v19.86,57.37
  Bottom 0.61: v19.86,57.37 19.86,59.12 24.62,63.88 34.24,63.88 35.67,65.31 35.67,71.75 38.11,74.2 42.23,74.2 D4.KATODA
SENSOR_RF  (via drill 0.5)
  Top 0.61: IC1.11 v22.39,57.38
  Bottom 0.61: v22.39,57.38 22.39,58.32 25.89,61.5 52.88,61.5 56.75,65.37 D5.KATODA
SENSOR_RS  (via drill 0.5)
  Top 0.61: IC1.10 v23.66,57.38
  Bottom 0.61: v23.66,57.38 26.52,60.39 42.24,60.39 48.11,54.51 60.61,54.51 D6.KATODA
SWCLK  (via drill 0.3)
  Top 0.254: v49.22,35.78 49.54,35.78 50.49,34.83 50.49,31.49 50.02,31.02 50.02,19.43 51.29,18.16 61.13,18.16 63.19,16.1 63.19,13.24 61.77,11.81 60.5,11.81 59.86,12.45 59.86,13.56 61.13,14.83 SV1.7 | U$6.PA14 43.45,41.24 43.67,41.02 43.67,35.78 v43.51,35.78
  Bottom 0.254: v43.51,35.78 v49.22,35.78
SWDIO  (via drill 0.3)
  Top 0.254: v48.27,34.99 49.38,34.99 49.86,34.51 49.86,31.65 49.38,31.18 49.38,19.27 51.13,17.52 60.97,17.52 62.56,15.94 62.56,14.51 SV1.5 | v39.76,37.81 U$6.PA13
  Bottom 0.254: v48.27,34.99 42.58,34.99 v39.76,37.81
VCAP_1
  Top 0.254: VCAP_1.1 29.45,41.74 U$6.VCAP_1
VCAP_2
  Top 0.254: U$6.VCAP_2 40.25,38.41 40.65,38 40.68,36.12 41.6,35.2 41.57,32.74 42.13,32.18 42.92,32.18 VCAP_2.1

### Text on the board
tPlace: BT | PG | RX-CK | TX-IO | GND | +3V3
bPlace: C:/Users/Karol/Desktop/pixi.bmp
tNames: PL | C:/Users/Karol/Desktop/pixi.bmp
bNames: K. Dworakowski | K. Trzcinski
200bmp: C:/Users/Karol/Desktop/pixi.bmp